# EAGLE design pod (EAGLE 5.12)
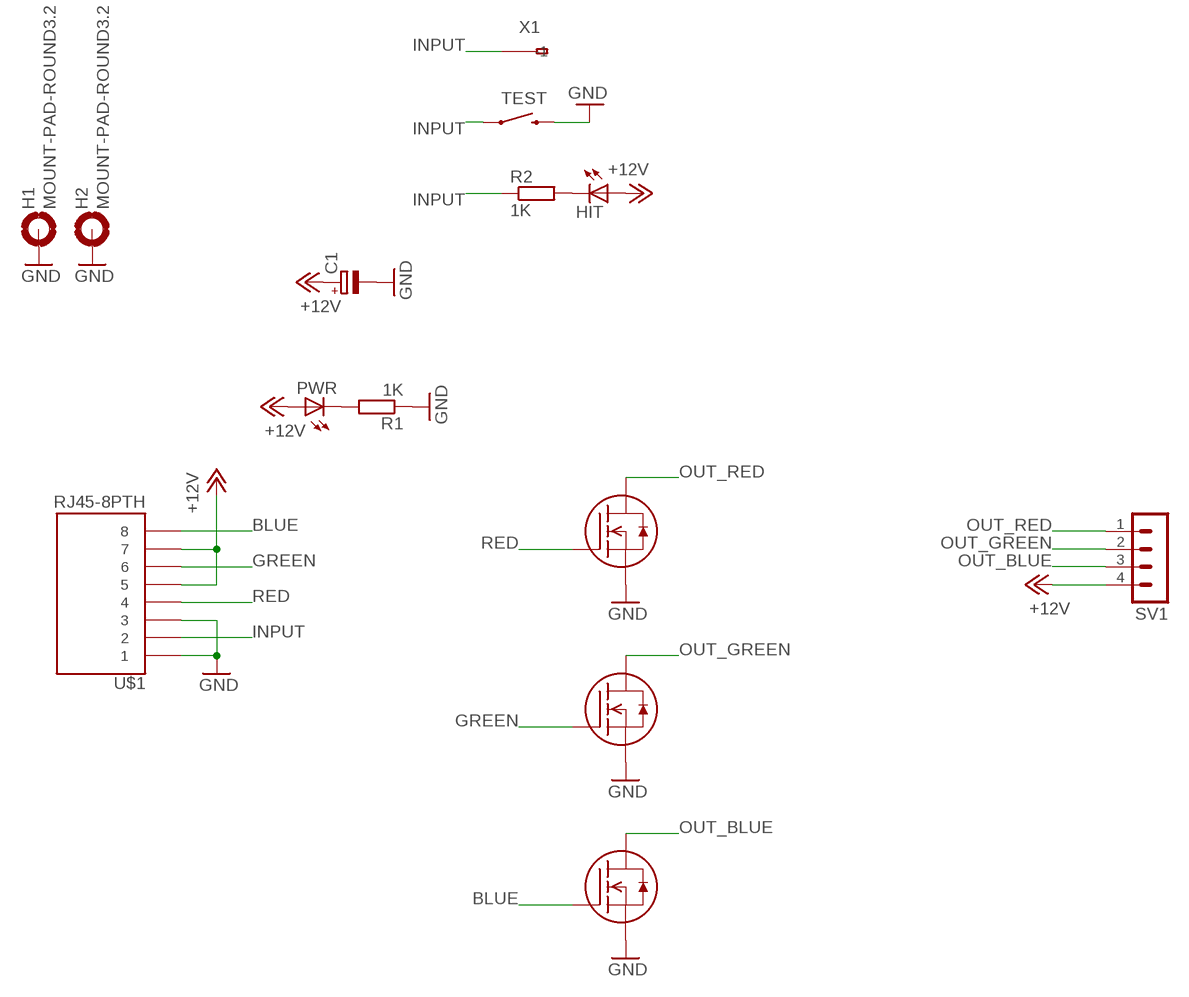
[diagram p0: schematic, sheet 1]

## Parts
C1  CPOL-EUE2.5-6  [E2,5-6]
H1  MOUNT-PAD-ROUND3.2  [3,2-PAD]
H2  MOUNT-PAD-ROUND3.2  [3,2-PAD]
HIT  LED3MM  [LED3MM]
PWR  LED3MM  [LED3MM]
R1  1K  R-EU_0207/10  [0207/10]
R2  1K  R-EU_0207/10  [0207/10]
SV1  MA04-1  [MA04-1]
TEST  SWITCH-MOMENTARY-2PTH  [TACTILE-PTH]
U$1  RJ45-8PTH  [RJ45-8]
U$2  NTF3055L108T1GTAB  [SOT223]
U$3  NTF3055L108T1GTAB  [SOT223]
U$4  NTF3055L108T1GTAB  [SOT223]
X1  255-401-5  [255-401-5]

## Nets
+12V: C1.+ HIT.A PWR.A SV1.4 U$1.5 U$1.7
BLUE: U$1.8 U$4.1(G)
GND: C1.- H1.B3,2(MOUNT) H2.B3,2(MOUNT) R1.1 TEST.3 U$1.1 U$1.3 U$2.3(S) U$3.3(S) U$4.3(S)
GREEN: U$1.6 U$3.1(G)
INPUT: R2.1 TEST.1 U$1.2 X1.A1(-1)
N$1: PWR.K(C) R1.2
N$2: HIT.K(C) R2.2
OUT_BLUE: SV1.3 U$4.4(D)
OUT_GREEN: SV1.2 U$3.4(D)
OUT_RED: SV1.1 U$2.4(D)
RED: U$1.4 U$2.1(G)
Unconnected: X1.B1(B-1)

## Library data of the parts
C1 = rcl:CPOL-EU: POLARIZED CAPACITOR, European symbol
H1 H2 = holes:MOUNT-PAD-ROUND: MOUNTING PAD, round
HIT PWR = led:LED: LED OSRAM: - CHIPLED LG R971, LG N971, LY N971, LG Q971, LY Q971, LO R971, LY R971 LH N974, LH R974 LS Q976, LO Q976, LY Q976 LO Q996 - Hyper CHIPLED LW Q18S LB Q993, LB Q99A, LB R99A - SideLED LS A670, LO A670, LY A670, LG A670, LP A670 LB A673, LV A673, LT A673, LW A673 LH A674 LY A675 LS A676, LA A676, LO A676, LY A676, LW A676 LS A679, LY A679, LG A679 - Hyper Micro SIDELED® LS Y876, LA Y876, LO Y876, LY Y876 LT Y87S - SmartLED LW L88C, LW L88S LB L89C, LB L89S, LG L890 LS L89K, LO L89K, LY L89K LS L896, LA L896, LO L896, LY L896 - TOPLED LS T670, LO T670, LY T670, LG T670, LP T670 LSG T670, LSP T670, LSY T670, LOP T670, LYG T670 LG T671, LOG T671, LSG T671 LB T673, LV T673, LT T673, LW T673 LH T674 LS T676, LA T676, LO T676, LY T676, LB T676, LH T676, LSB T676, LW T676 LB T67C, LV T67C, LT T67C, LS T67K, LO T67K, LY T67K, LW E67C LS E67B, LA E67B, LO E67B, LY E67B, LB E67C, LV E67C, LT E67C LW T67C LS T679, LY T679, LG T679 LS T770, LO T770, LY T770, LG T770, LP T770 LB T773, LV T773, LT T773, LW T773 LH T774 LS E675, LA E675, LY E675, LS T675 LS T776, LA T776, LO T776, LY T776, LB T776 LHGB T686 LT T68C, LB T68C - Hyper Mini TOPLED® LB M676 - Mini TOPLED Santana® LG M470 LS M47K, LO M47K, LY M47K Source: http://www.osram.convergy.de LUXEON: - LUMILED® LXK2-PW12-R00, LXK2-PW12-S00, LXK2-PW14-U00, LXK2-PW14-V00 LXK2-PM12-R00, LXK2-PM12-S00, LXK2-PM14-U00 LXK2-PE12-Q00, LXK2-PE12-R00, LXK2-PE12-S00, LXK2-PE14-T00, LXK2-PE14-U00 LXK2-PB12-K00, LXK2-PB12-L00, LXK2-PB12-M00, LXK2-PB14-N00, LXK2-PB14-P00, LXK2-PB14-Q00 LXK2-PR12-L00, LXK2-PR12-M00, LXK2-PR14-Q00, LXK2-PR14-R00 LXK2-PD12-Q00, LXK2-PD12-R00, LXK2-PD12-S00 LXK2-PH12-R00, LXK2-PH12-S00 LXK2-PL12-P00, LXK2-PL12-Q00, LXK2-PL12-R00 Source: www.luxeon.com KINGBRIGHT: KA-3528ASYC Source: www.kingbright.com
R1 R2 = rcl:R-EU_: RESISTOR, European symbol
SV1 = con-lstb:MA04-1: PIN HEADER; OC_FARNELL: unknown; OC_NEWARK: unknown
TEST = SparkFun:SWITCH-MOMENTARY-2
U$1 = SparkFun:RJ45-8: RJ45 Jack Simple RJ45, 8-pin connection - connector for common Cat5, Cat5e, and Cat6 Ethernet cables. Footprint not yet proven in production. Connector sku is PRT-00643; Breakout PCB sku is BOB-00716.
U$2-U$4 = NTF3055L108:NTF3055L108T1G: Power MOSFET 3.0 A, 60 V, Logic Level, N?Channel SOT?223 Designed for low voltage, high speed switching applications in power supplies, converters and power motor controls and bridge circuits
X1 = con-wago255:255-401-5: WAGO; OC_FARNELL: unknown; OC_NEWARK: unknown

## Board
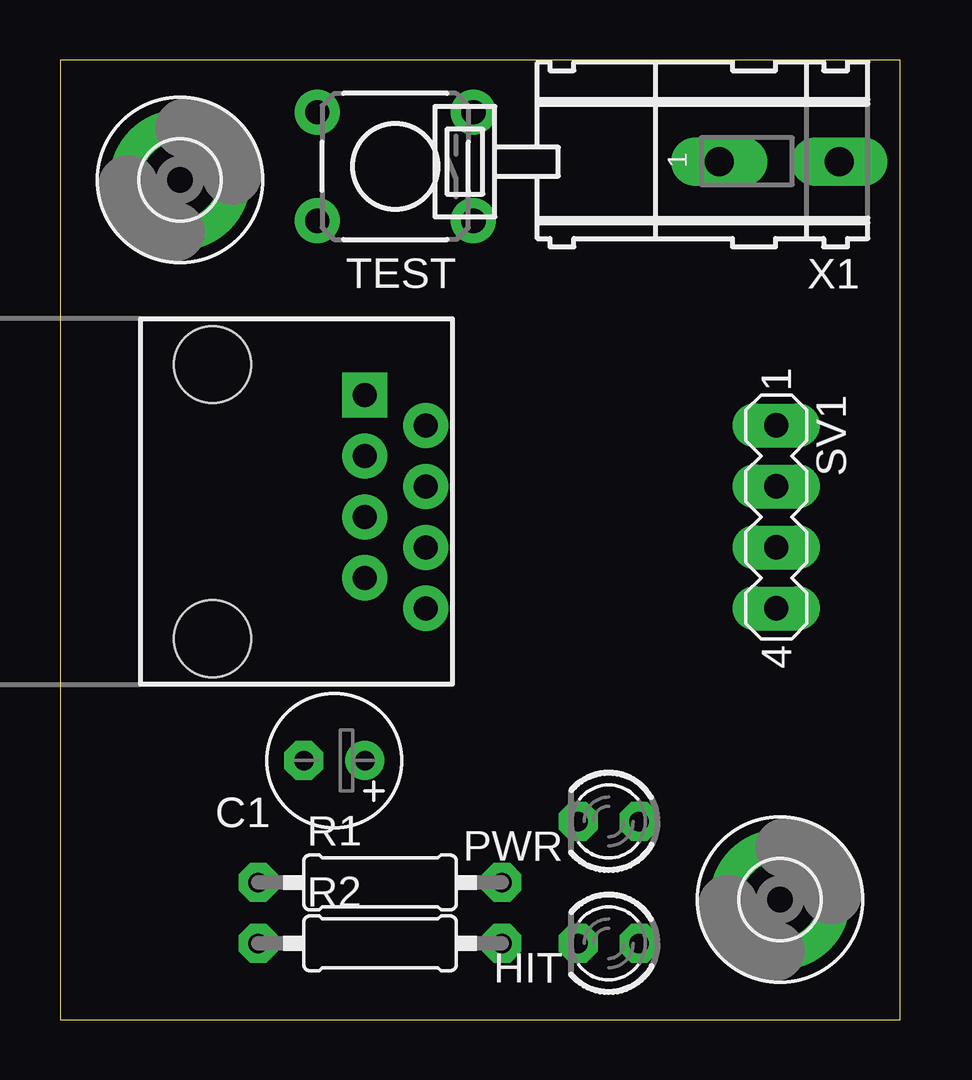
[diagram p1: board, top side]
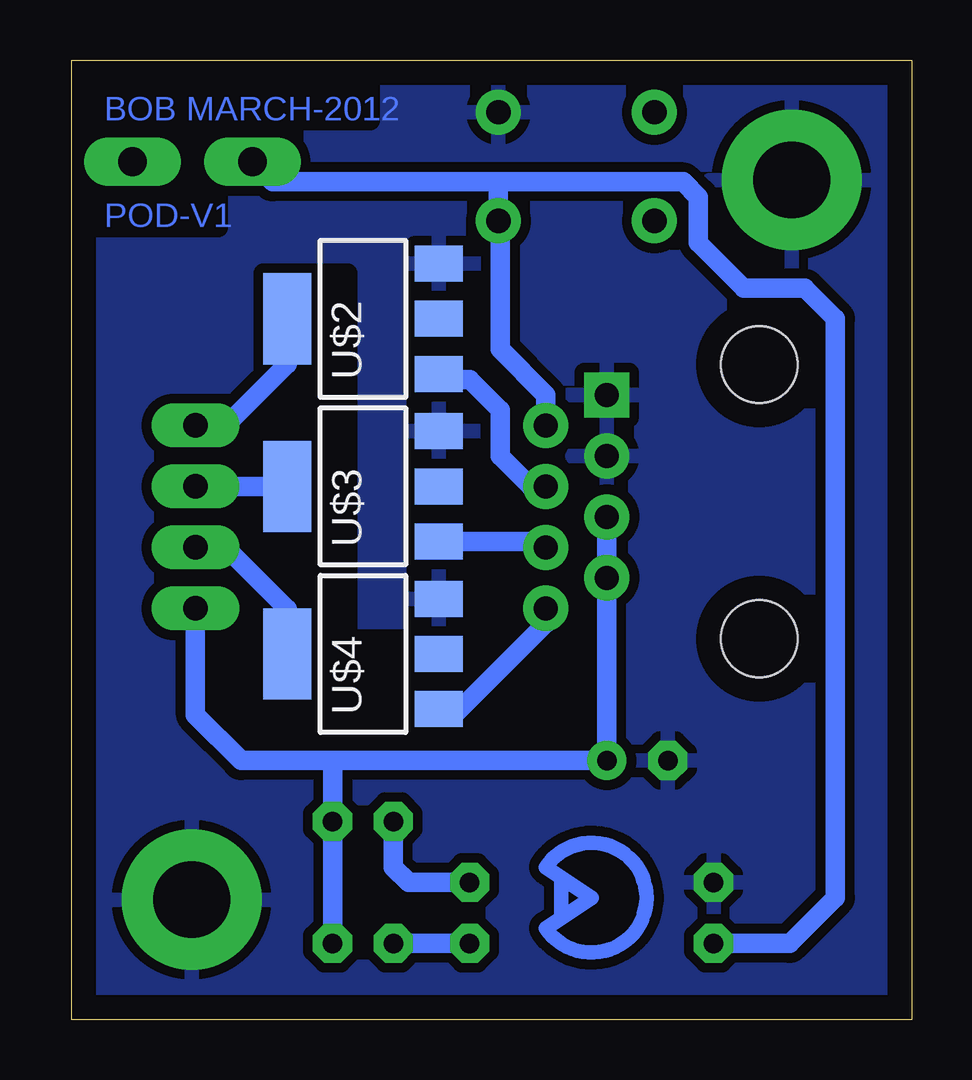
[diagram p2: board, bottom side, seen from below]

Size 35 x 40 mm. Coordinates in mm from the lower left corner, seen from the top.
Outline: 0,0 35,0 35,40 0,40 0,0
Copper layers (1*16): Top 0.035mm / dielectric 1.5mm / Bottom 0.035mm
Design rules "default *": minimum track width 10mil, minimum drill 0.8mm, track to track 8mil, track to pad 8mil, pad to pad 8mil, via to via 8mil, smd to smd 8mil, copper to edge 40mil, drill to drill 8mil, minimum pad ring 16mil, minimum via ring 8mil, stop-mask expansion 4mil, vias tented up to drill 0mil, thermal gap 16mil
bRestrict: 4 lines

### Footprints (pad centres in the part's own frame; a part is rotated, then mirrored left to right if it is on the bottom)
E2,5-6 = drill 0.813 pad 1.6 round: + -1.27,0 | drill 0.813 pad 1.6 octagon: - 1.27,0
3,2-PAD = drill 3.2 pad 5.842 round: B3,2 0,0
LED3MM = drill 0.813 octagon: A -1.27,0; K 1.27,0
0207/10 = drill 0.813 octagon: 1 -5.08,0; 2 5.08,0
MA04-1 = drill 1.016 long: 1 -3.81,0; 2 -1.27,0; 3 1.27,0; 4 3.81,0
TACTILE-PTH = drill 1.016 pad 1.88 round: 1 -3.251,2.261; 2 3.251,2.261; 3 -3.251,-2.261; 4 3.251,-2.261
RJ45-8 = drill 1 pad 1.88 square: 1 -4.445,6.35 | drill 1 pad 1.88 round: 2 -3.175,8.89; 3 -1.905,6.35; 4 -0.635,8.89; 5 0.635,6.35; 6 1.905,8.89; 7 3.175,6.35; 8 4.445,8.89 | hole 3.2: -5.715,0; 5.715,0
SOT223 = smd 1.5 x 2: 1 -2.3,-3.15; 2 0,-3.15; 3 2.3,-3.15 | smd 3.8 x 2: 4 0,3.15
255-401-5 = drill 1.2 long: A1 -2.5,0; B1 -2.5,-5

### Placement (x,y rotation side)
C1  11.43,10.79 180 top
H1  30,5 0 top
H2  5,35 0 top
HIT  22.86,3.17 180 top
PWR  22.86,8.26 180 top
R1  13.34,5.71 0 top
R2  13.34,3.17 0 top
SV1  29.84,20.95 270 top
TEST  13.97,35.56 180 top
U$1  6.35,21.59 270 top
U$2  22.86,29.21 90 bottom
U$3  22.86,22.23 90 bottom
U$4  22.86,15.24 90 bottom
X1  27.46,38.26 90 top

### Tracks (layer width: path | path; a pad name or v marks a point on that pad's centre or on a via)
+12V
  Bottom 0.813: 24.13,10.79 27.94,10.79 29.84,12.7 SV1.4 | HIT.A PWR.A 24.13,10.79 | U$1.5 U$1.7 C1.+ 24.13,10.79
BLUE
  Bottom 0.813: U$1.8 15.24,16.51 19.05,12.7 19.47,12.7 U$4.1
GND
  pour Bottom (isolate 0.406): -2.54,42.55 36.83,42.55 36.83,-3.81 -2.54,-3.81
GREEN
  Bottom 0.813: U$1.6 15.48,19.93 U$3.1
INPUT
  Bottom 0.813: R2.1 5.08,3.17 3.17,5.08 3.17,29.21 4.45,30.48 6.99,30.48 8.89,32.38 8.89,34.29 9.53,34.92 17.22,34.92 | U$1.2 15.24,26.04 17.14,27.94 17.14,33.22 TEST.1 17.22,34.92 | 17.22,34.92 26.63,34.92 X1.A1
N$1
  Bottom 0.813: R1.2 20.95,5.71 21.59,6.35 PWR.K
N$2
  Bottom 0.813: R2.2 HIT.K
N$3
  Bottom 0.61: 15.24,6.35 arc293 15.24,3.81 13.34,5.08 15.24,6.35
N$4
  Bottom 0.61: 14.61,4.45 14.61,5.71
N$5
  Bottom 0.254: 6.99,26.67 5.71,27.94
N$6
  Bottom 0.254: 5.71,26.67 6.99,27.94
N$7
  Bottom 0.254: 6.99,15.24 5.71,16.51
N$8
  Bottom 0.254: 5.71,15.24 6.99,16.51
OUT_BLUE
  Bottom 0.813: SV1.3 28.57,19.68 26.01,17.12 U$4.4
OUT_GREEN
  Bottom 0.813: U$3.4 SV1.2
OUT_RED
  Bottom 0.813: SV1.1 28.57,24.77 26.01,27.33 U$2.4
RED
  Bottom 0.813: U$1.4 15.88,22.23 17.14,23.5 17.14,25.4 18.41,26.67 19.47,26.67 U$2.1

### Text on the board
Bottom: BOB MARCH-2012 | POD-V1